# EAGLE schematic powerBoard-2nd (EAGLE 7.2.0)
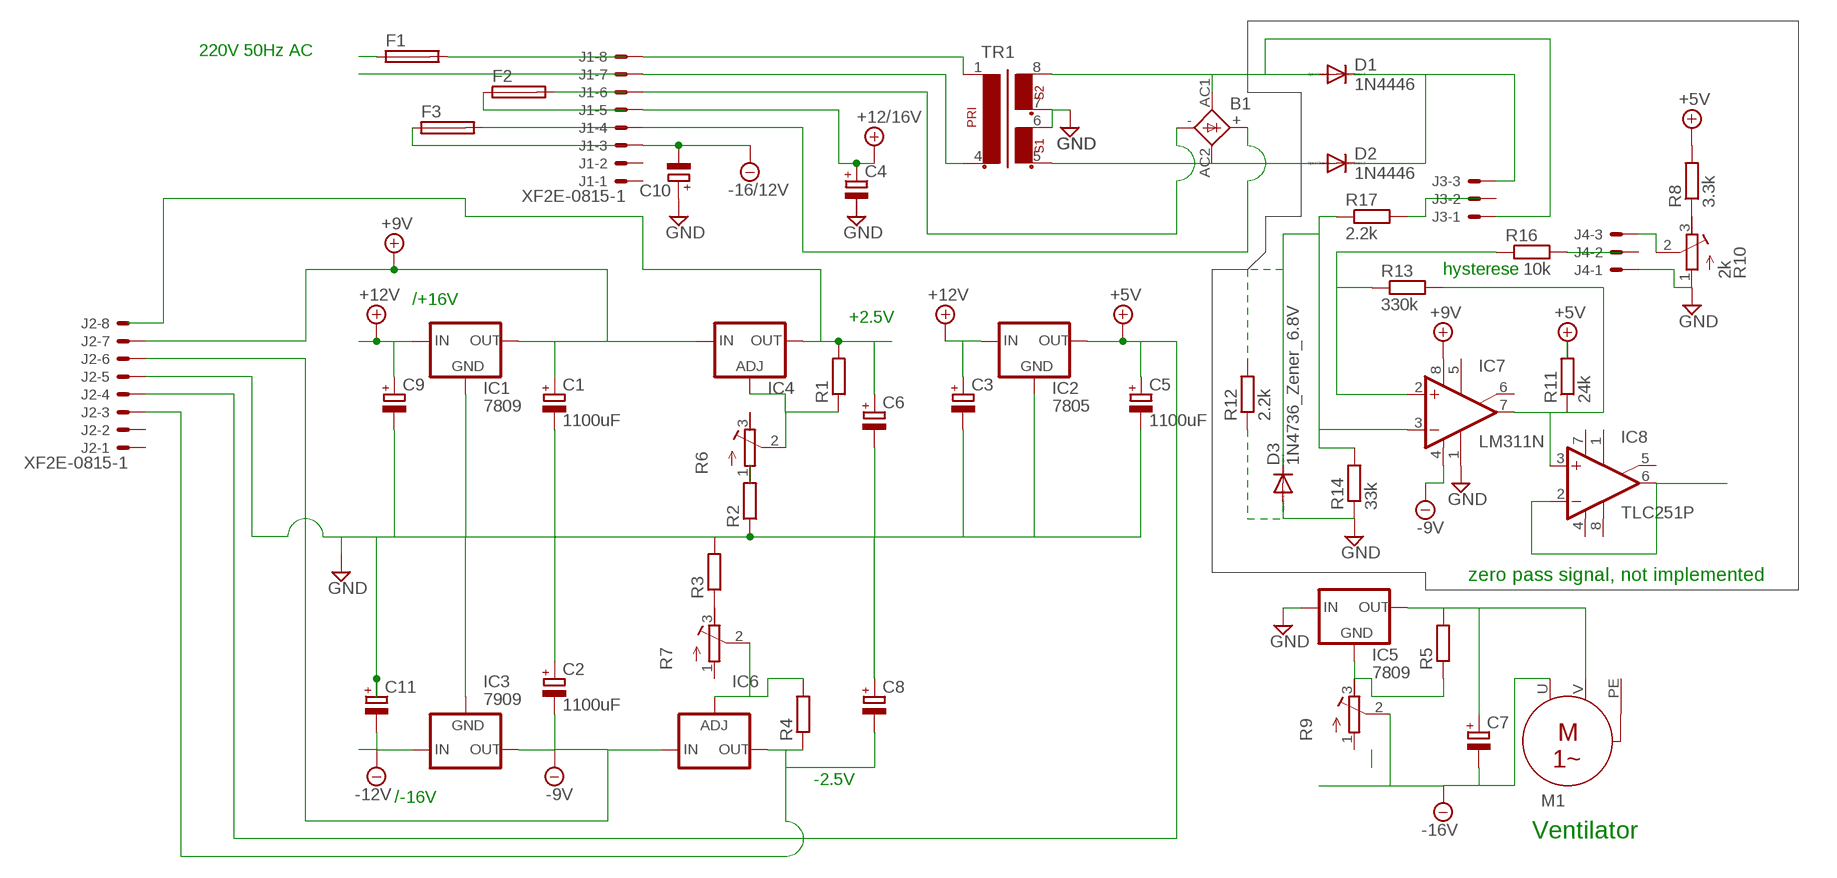
[diagram p0: schematic, sheet 1]

## Parts
B1  DSI32A  [DSI32A]
C1  1100uF  CPOL-EUE22-6AXIAL  [E22-6]
C2  1100uF  CPOL-EUE22-6AXIAL  [E22-6]
C3  CPOL-EUE22-6AXIAL  [E22-6]
C4  CPOL-EUE22-6AXIAL  [E22-6]
C5  1100uF  CPOL-EUE22-6AXIAL  [E22-6]
C6  CPOL-EUE22-6AXIAL  [E22-6]
C7  CPOL-EUE22-6AXIAL  [E22-6]
C8  CPOL-EUE22-6AXIAL  [E22-6]
C9  CPOL-EUE22-6AXIAL  [E22-6]
C10  CPOL-EUE22-6AXIAL  [E22-6]
C11  CPOL-EUE22-6AXIAL  [E22-6]
D1  1N4446  [DO35-10]
D2  1N4446  [DO35-10]
D3  1N4736_Zener_6.8V  1N4446  [DO35-10]
F1  SH25  [SH25]
F2  SH25  [SH25]
F3  SH25  [SH25]
IC1  7809  78LXX  [78LXX]
IC2  7805  78LXX  [78LXX]
IC3  7909  79LXX  [79LXX]
IC4  LM317-T039  [TO39-H03]
IC5  7809  78LXX  [78LXX]
IC6  LM337-TO3  [TO3-K02]
IC7  LM311N  [DIL08]
IC8  TLC251P  [DIL08]
J1  XF2E-0815-1  [XF2E-0815-1]
J2  XF2E-0815-1  [XF2E-0815-1]
J3  XF2E-0815-1  [XF2E-0815-1]
J4  XF2E-0815-1  [XF2E-0815-1]
M1  MOTOR_1-PHASEN  [MOTOR_1-PHASEN]
R1  R-EU_0309/V  [0309V]
R2  R-EU_0309/V  [0309V]
R3  R-EU_0309/V  [0309V]
R4  R-EU_0309/V  [0309V]
R5  R-EU_0309/V  [0309V]
R6  R-TRIMM4G/J  [RTRIM4G/J]
R7  R-TRIMM4G/J  [RTRIM4G/J]
R8  3.3k  R-EU_0309/V  [0309V]
R9  R-TRIMM4G/J  [RTRIM4G/J]
R10  2k  R-TRIMM4G/J  [RTRIM4G/J]
R11  24k  R-EU_0309/V  [0309V]
R12  2.2k  R-EU_0309/V  [0309V]
R13  330k  R-EU_0309/V  [0309V]
R14  33k  R-EU_0309/V  [0309V]
R16  10k  R-EU_0309/V  [0309V]
R17  2.2k  R-EU_0309/V  [0309V]
TR1  EE20-2  [EE20-2]

## Nets
+5V: C5.+ IC2.OUT J2.4 R8.2 R11.2
+9V: C1.+ IC1.OUT IC4.1(IN) IC7.8(V+) J2.7
+12V: C3.+ C4.+ C9.+ IC1.IN IC2.IN J1.5 ; supply symbol labelled +12/16V
-9V: C2.- IC3.OUT IC6.3(IN) IC7.4(V-) J2.6
-12V: C7.- C10.- C11.- IC3.IN J1.3 M1.U R9.2(S) ; supply symbol labelled -16V, -16/12V
GND: C1.- C2.+ C3.- C5.- C6.- C8.+ C9.- C10.+ C11.+ D3.A IC1.GND IC2.GND IC3.GND IC5.IN IC7.1(GND) J2.5 J4.1 R2.1 R3.2 R10.1(A) R12.1 R14.1 TR1.6 TR1.7
N$1: J1.8 TR1.1
N$2: J1.7 TR1.4
N$3: B1.AC1 D1.A J3.1 TR1.8
N$4: D2.A
N$5: F2.2
N$6: D1.C D2.C J3.3
N$7: B1.- J1.6
N$8: F1.2
N$10: R3.1 R7.3(E)
N$11: F2.1
N$12: F3.2
N$13: F3.1
N$14: F1.1
N$16: C7.+ IC5.OUT M1.V R5.2
N$17: IC5.GND R5.1 R9.3(E)
N$18: IC4.2(ADJ) R1.1 R6.2(S)
N$19: R2.2 R6.1(A)
N$20: IC6.2(ADJ) R4.2 R7.2(S)
N$21: C8.- IC6.1(OUT) J2.3 R4.1
N$22: D3.C IC7.3(-IN) R12.2 R14.2 R17.1
N$23: C6.+ IC4.3(OUT) J2.8 R1.2
N$24: B1.AC2 TR1.5
N$25: R17.2
N$26: R8.1 R10.3(E)
N$27: R16.2
N$28: IC7.2(+IN) R13.1 R16.1
N$29: IC7.7(OUT) IC8.3(+IN) R11.1 R13.2
N$30: IC8.2(-IN) IC8.6(OUT)
N$31: J4.3 R10.2(S)
N$32: B1.+ J1.4
Unconnected: C4.- IC7.5(ON) IC7.6(ON/STR) IC8.1(ON1) IC8.5(ON2) IC8.8(OPT) J1.1 J1.2 J2.1 J2.2 J3.2 J3.4 J3.5 J3.6 J3.7 J3.8 J4.2 J4.4 J4.5 J4.6 J4.7 J4.8 M1.PE R6.3(E) R7.1(A) R9.1(A)

## Notes on the sheet
- 220V 50Hz AC
- hysterese
- /+16V
- +2.5V
- zero pass signal, not implemented
- -2.5V
- /-16V
- Ventilator

## Power pins joined to a net without a drawn wire
V+: IC8.7(V+)
V-: IC8.4(V-)

## Library data of the parts
B1 = rectifier:DSI32A: RECTIFIER 3.2 A
C1-C11 = resistor:CPOL-EU: POLARIZED CAPACITOR, European symbol
D1-D3 = diode:1N4446: DIODE high speed (Philips)
F1-F3 = fuse:SH25: FUSE HOLDER grid 25 mm, OGN0031 8211, Schurter (Buerklin)
IC1 IC2 IC5 = v-reg:78LXX: VOLTAGE REGULATOR
IC3 = v-reg:79LXX: VOLTAGE REGULATOR
IC4 = v-reg:LM317-T039: VOLTAGE REGULATOR
IC6 = v-reg:LM337-TO3: VOLTAGE REGULATOR
IC7 = linear:LM311: COMPARATOR
IC8 = linear:TLC251: OP AMP
J1-J4 = con-omron:XF2*-08?: OMRON FPC Connector Source : http://www.omron.com/ecb/products/pdf/fpc.pdf
M1 = e-motoren:MOTOR_1-PHASEN: 1-Phasen-Wechselstrom-Motor
R1-R5 R8 R11-R14 R16 R17 = resistor:R-EU_: RESISTOR, European symbol
R6 R7 R9 R10 = resistor:R-TRIMM: Trimm resistor
TR1 = trafo:EE20-2: TRANSFORMER 1 primary winding, 2 secondary windings ERA